# Altium schematic sheet BMS_V1.SchDoc
size 431 x 279 mm; SheetNumber: 1; SheetTotal: 1
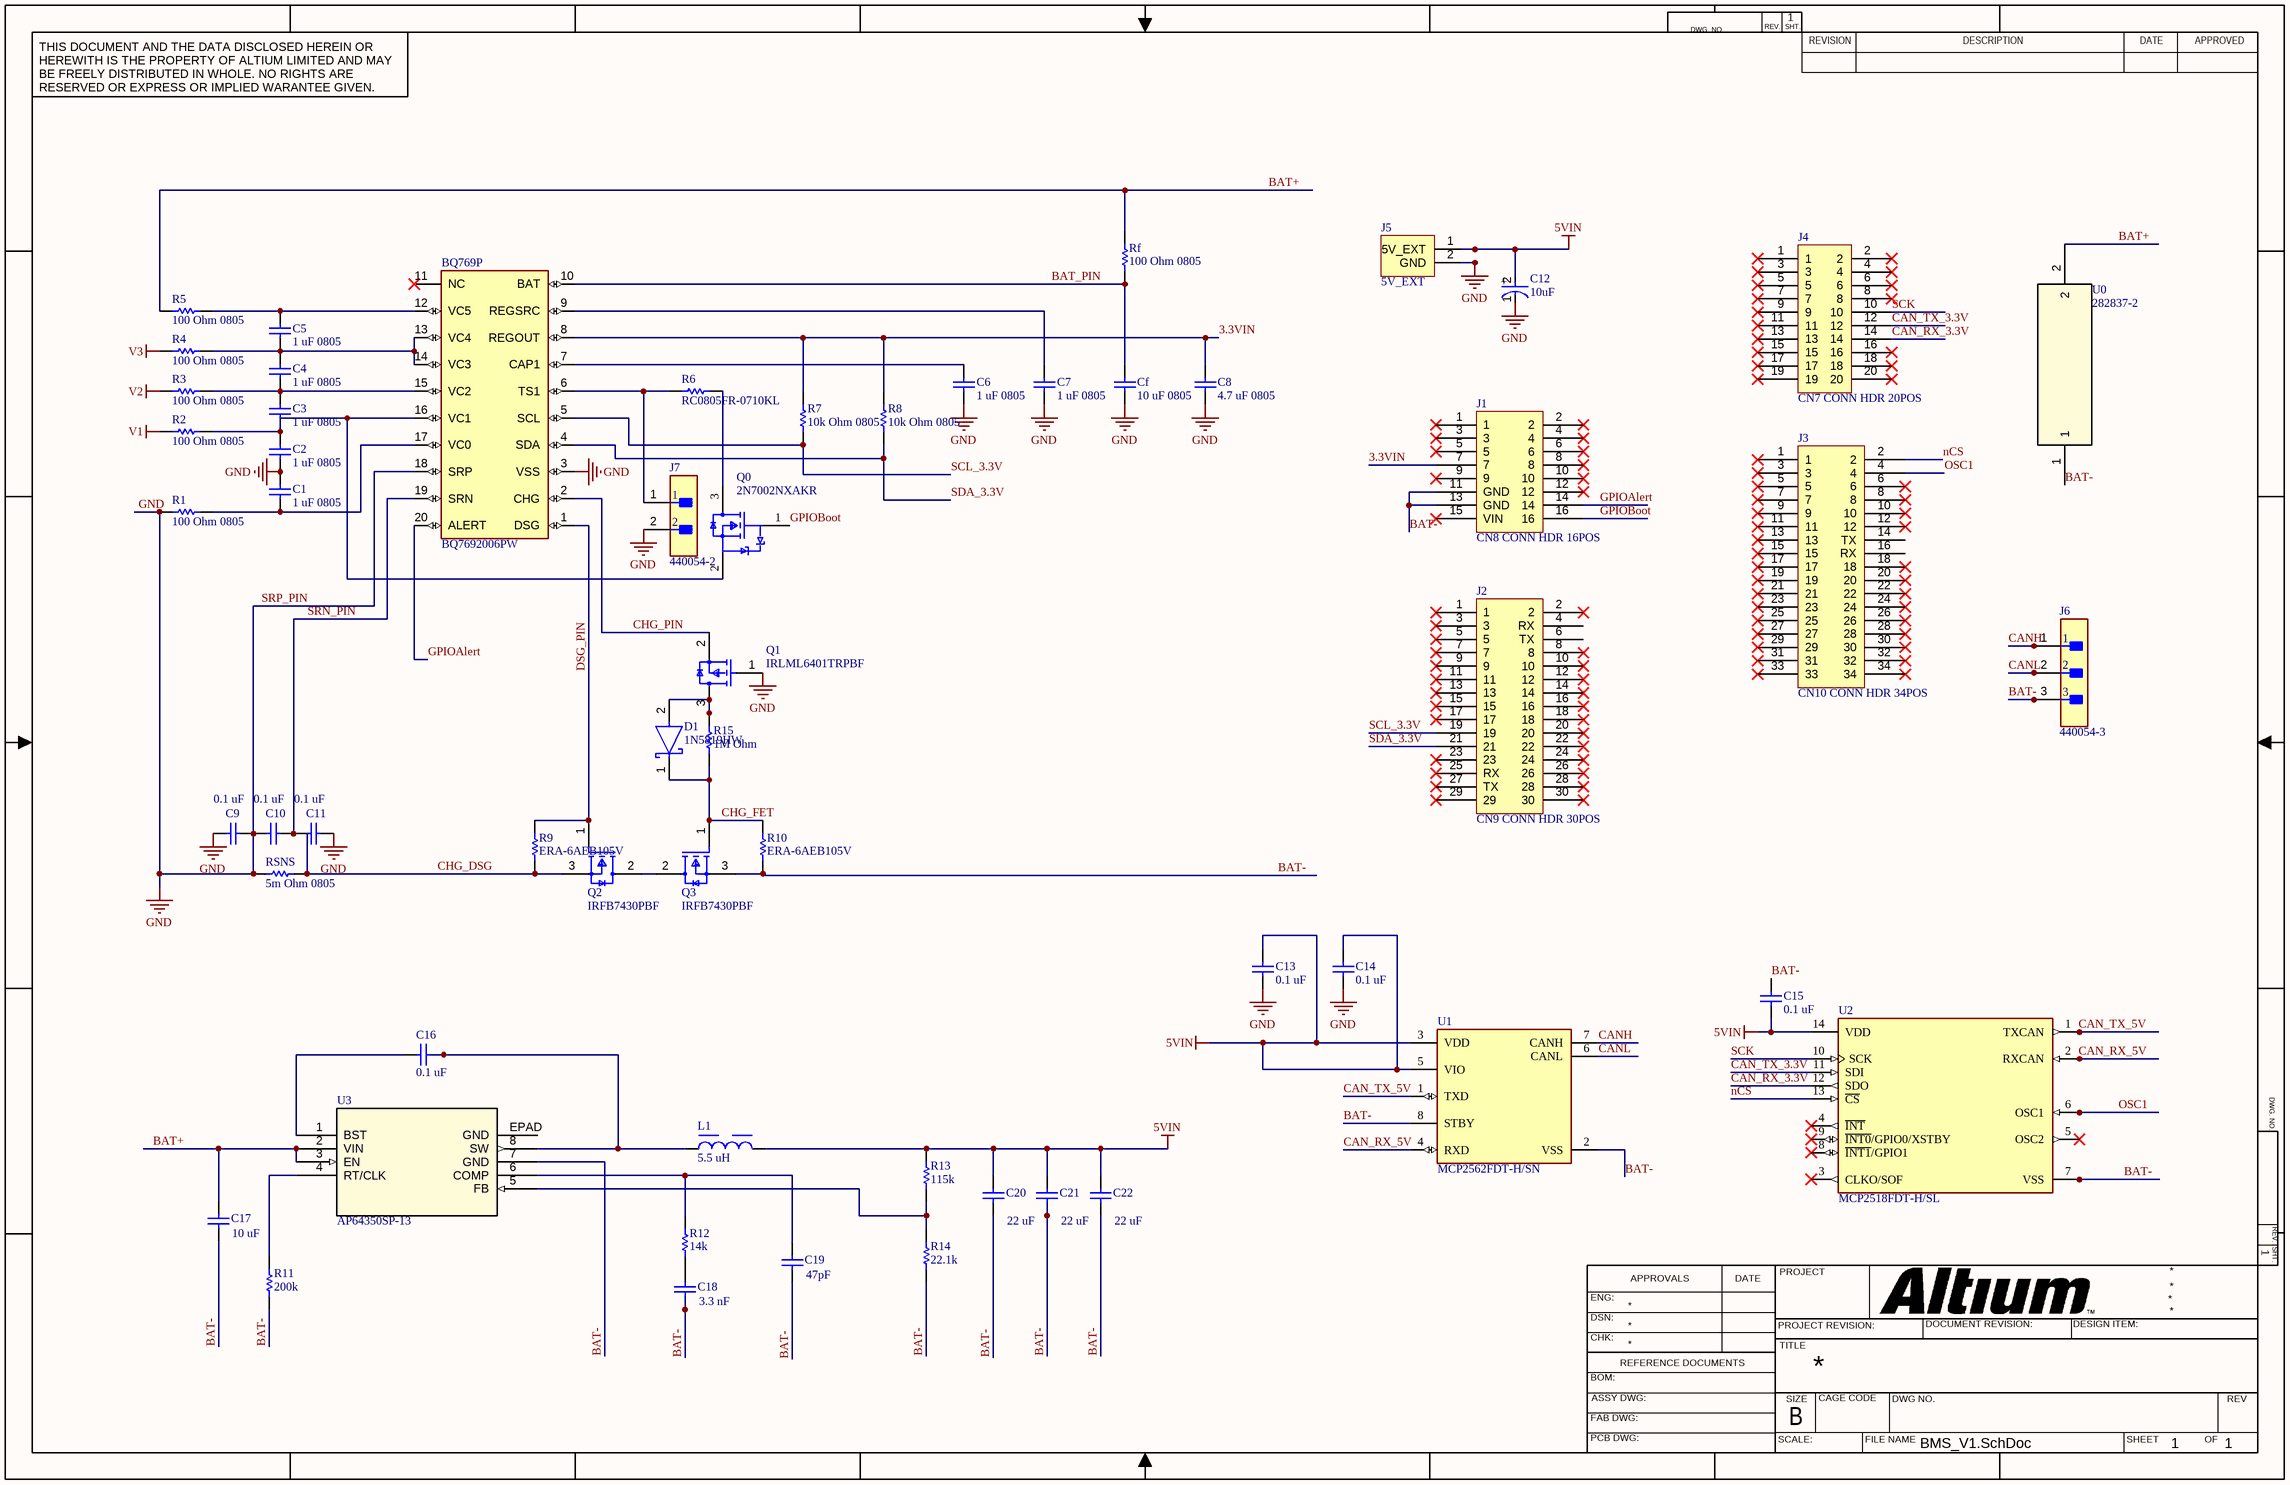
[diagram p0: BMS_V1.SchDoc]

## Parts
BQ769P  BQ7692006PW  [BQ7692006PW]
C1  1 uF 0805  [CAPC2013X140X50LL20T25]
C2  1 uF 0805  [CAPC2013X140X50LL20T25]
C3  1 uF 0805  [CAPC2013X140X50LL20T25]
C4  1 uF 0805  [CAPC2013X140X50LL20T25]
C5  1 uF 0805  [CAPC2013X140X50LL20T25]
C6  1 uF 0805  [CAPC2013X140X50LL20T25]
C7  1 uF 0805  [CAPC2013X140X50LL20T25]
C8  4.7 uF 0805  [CAPC2013X140X50LL20T25]
C9  0.1 uF  [CAPC2013X140X50LL20T25]
C10  0.1 uF  [CAPC2013X140X50LL20T25]
C11  0.1 uF  [CAPC2013X140X50LL20T25]
C12  10uF  [FP-FKC-MFG]
C13  0.1 uF  [CAPC2013X135X45NL10T25]
C14  0.1 uF  [CAPC2013X135X45NL10T25]
C15  0.1 uF  [CAPC2013X135X45NL10T25]
C16  0.1 uF  [CAPC2013X135X45NL10T25]
C17  10 uF  [CAPC2013X135X45NL10T25]
C18  3.3 nF  [CAPC2013X135X45NL10T25]
C19  47pF  [CAPC2013X135X45NL10T25]
C20  22 uF  [CAPC2013X135X45NL10T25]
C21  22 uF  [CAPC2013X135X45NL10T25]
C22  22 uF  [CAPC2013X135X45NL10T25]
Cf  10 uF 0805  [CAPC2013X140X50LL20T25]
D1  1N5819HW  [FP-SOD123-IPC_A]
J1  CN8 CONN HDR 16POS  [CN8_8X2_PADS]
J2  CN9 CONN HDR 30POS  [CN9_15X2_PADS]
J3  CN10 CONN HDR 34POS  [CN10_17X2_PADS]
J4  CN7 CONN HDR 20POS  [CN7_10X2_PADS]
J5  5V_EXT  [5V_EXT]
J6  440054-3  [FP-440054-3-MFG]
J7  440054-2  [FP-440054-2-MFG]
L1  5.5 uH  [WE-HCI_1050]
Q0  2N7002NXAKR  [FP-SOT23-IPC_B]
Q1  IRLML6401TRPBF  [FP-SOT23-MFG]
Q2  IRFB7430PBF  [FP-PG-TO220-3-MFG]
Q3  IRFB7430PBF  [FP-PG-TO220-3-MFG]
R1  100 Ohm 0805  [RESC2013X60X30ML20T20]
R2  100 Ohm 0805  [RESC2013X60X30ML20T20]
R3  100 Ohm 0805  [RESC2013X60X30ML20T20]
R4  100 Ohm 0805  [RESC2013X60X30ML20T20]
R5  100 Ohm 0805  [RESC2013X60X30ML20T20]
R6  RC0805FR-0710KL  [RESC2013X60X35NL10T20]
R7  10k Ohm 0805  [RESC2013X60X30ML20T20]
R8  10k Ohm 0805  [RESC2013X60X30ML20T20]
R9  ERA-6AEB105V  [RESC2013X60X40LL20T25]
R10  ERA-6AEB105V  [RESC2013X60X40LL20T25]
R11  200k  [RESC2013X60X35ML10T20]
R12  14k  [RESC2013X60X35ML10T20]
R13  115k  [RESC2013X60X35ML10T20]
R14  22.1k  [RESC2013X60X35ML10T20]
R15  1M Ohm  [RESC2013X60X40LL20T25]
Rf  100 Ohm 0805  [RESC2013X60X30ML20T20]
RSNS  5m Ohm 0805  [RESC2013X60X30ML20T20]
U0  282837-2  [282837-2_TYC]
U1  MCP2562FDT-H/SN  [FP-C04-057-SN-IPC_A]
U2  MCP2518FDT-H/SL  [FP-C04-065-SL-IPC_B]
U3  AP64350SP-13  [SO-8EP_DIO]

## Nets
5VIN: C12.2(A) C13.2 C14.2 C15.1 C20.2 C21.2 C22.2 J5.1(5V_EXT) L1.2 R13.2 U1.3(VDD) U1.5(VIO) U2.14(VDD)
GND: BQ769P.3(VSS) BQ769P.18(SRP) C1.2 C2.1 C6.1 C7.1 C8.1 C9.1 C9.2 C10.2 C11.1 C12.1(C) C13.1 C14.1 Cf.1 J5.2(GND) J7.2 Q1.1(G) R1.1 RSNS.2  [also labelled SRP_PIN]
V1: R2.1
V2: R3.1
V3: R4.1
3.3VIN: BQ769P.8(REGOUT) C8.2 J1.7 R7.2 R8.2
BAT+: C17.2 R5.1 Rf.2 U0.2 U3.2(VIN) U3.3(EN)
BAT-: C15.2 C17.1 C18.1 C19.1 C20.1 C21.1 C22.1 J1.11(GND) J1.13(GND) J6.3 Q3.3(S) R10.1 R11.1 R14.1 U0.1 U1.2(VSS) U1.8(STBY) U2.7(VSS) U3.7(GND)
BAT_PIN: BQ769P.10(BAT) Cf.2 Rf.1
CAN_RX_3.3V: J4.14 U2.12(SDO)
CAN_RX_5V: U1.4(RXD) U2.2(RXCAN)
CAN_TX_3.3V: J4.12 U2.11(SDI)
CAN_TX_5V: U1.1(TXD) U2.1(TXCAN)
CANH: J6.1 U1.7(CANH)
CANL: J6.2 U1.6(CANL)
CHG_DSG: Q2.3(S) R9.1 RSNS.1
CHG_FET: D1.1(C) Q3.1(G) R10.2 R15.1
CHG_PIN: BQ769P.2(CHG) Q1.2(S)
DSG_PIN: BQ769P.1(DSG) Q2.1(G) R9.2
GPIOAlert: BQ769P.20(ALERT) J1.14
GPIOBoot: J1.16 Q0.1(G)
nCS: J3.2 U2.13(~{CS})
OSC1: J3.4 U2.6(OSC1)
SCK: J4.10 U2.10(SCK)
SCL_3.3V: BQ769P.5(SCL) J2.19 R7.1
SDA_3.3V: BQ769P.4(SDA) J2.21 R8.1
SRN_PIN: BQ769P.19(SRN) C10.1 C11.2
NetBQ769P_6: BQ769P.6(TS1) J7.1 R6.1
NetBQ769P_7: BQ769P.7(CAP1) C6.2
NetBQ769P_9: BQ769P.9(REGSRC) C7.2
NetBQ769P_12: BQ769P.12(VC5) C5.2 R5.2
NetBQ769P_13: BQ769P.13(VC4) BQ769P.14(VC3) C4.2 C5.1 R4.2
NetBQ769P_15: BQ769P.15(VC2) C3.2 C4.1 R3.2
NetBQ769P_16: BQ769P.16(VC1) C2.2 C3.1 Q0.2(S) R2.2
NetBQ769P_17: BQ769P.17(VC0) C1.1 R1.2
NetC16_1: C16.1 L1.1 U3.8(SW)
NetC16_2: C16.2 U3.1(BST)
NetC18_2: C18.2 R12.1
NetC19_2: C19.2 R12.2 U3.6(COMP)
NetD1_2: D1.2(A) Q1.3(D) R15.2
NetQ0_3: Q0.3(D) R6.2
NetQ2_2: Q2.2(D) Q3.2(D)
NetR11_2: R11.2 U3.4(RT/CLK)
NetR13_1: R13.1 R14.2 U3.5(FB)

Not connected (* = marked no-connect by the designer): BQ769P 11(NC)*; J1 1* 2* 3* 4* 5* 6* 8* 9* 10* 12* 15(VIN)*; J2 1* 2* 3* 4(RX) 5* 6(TX) 7* 8* 9* 10* 11* 12* 13* 14* 15* 16* 17* 18* 20* 22* 23* 24* 25(RX)* 26* 27(TX)* 28* 29* 30*; J3 1* 3* 5* 6* 7* 8* 9* 10* 11* 12* 13* 14(TX) 15* 16(RX) 17* 18* 19* 20* 21* 22* 23* 24* 25* 26* 27* 28* 29* 30* 31* 32* 33* 34*; J4 1* 2* 3* 4* 5* 6* 7* 8* 9* 11* 13* 15* 16* 17* 18* 19* 20*; U2 3(CLKO/SOF)* 4(~{INT})* 5(OSC2)* 8(~{INT1}/GPIO1)* 9(~{INT0}/GPIO0/XSTBY)*; U3 EPAD(GND)

## Notes on the sheet
- DWG. NO.
- REV.
- SHT.
- THIS DOCUMENT AND THE DATA DISCLOSED HEREIN OR HEREWITH IS THE PROPERTY OF ALTIUM LIMITED AND MAY BE FREELY DISTRIBUTED IN WHOLE. NO RIGHTS ARE RESERVED OR EXPRESS OR IMPLIED WARANTEE GIVEN.
- REVISION
- DESCRIPTION
- DATE
- APPROVED
- ENG:
- APPROVALS
- PROJECT
- DSN:
- CHK:
- REFERENCE DOCUMENTS
- PROJECT REVISION:
- TITLE
- DOCUMENT REVISION:
- DESIGN ITEM:
- BOM:
- FAB DWG:
- PCB DWG:
- ASSY DWG:
- SCALE:
- SIZE
- B
- CAGE CODE
- FILE NAME
- DWG NO.
- SHEET
- OF
- REV
- (in symbol CMP-05427-000030-1) +

## Library data of the parts
BQ769P = CMP-006-000000-1: 3 to 5-Series Cell Li-Ion and Li-Phosphate Battery Monitor (bq76940 Family); MF: Texas Instruments; Design Item ID: BQ7692006PW; Pin Count: 20; Value: *; Source: BQ7692006PW.SchLib; MP: BQ7692006PW; Component Type: Standard; Check_prices: https://www.snapeda.com/parts/BQ7692006PW/Texas+Instruments/view-part/?ref=eda; Package: TSSOP-20 Texas Instruments; SnapEDA_Link: https://www.snapeda.com/parts/BQ7692006PW/Texas+Instruments/view-part/?ref=snap
C1-C11 Cf = CMP-2007-03234-1: Part Number: C0805C105K3RACTU; Manufacturer: Kemet
C12 = CMP-05427-000030-1: CAP ALUM 10UF 20% 50V SMD; Impedance: 1.52R; Ripple Current (AC): 85mA; Life (Hours): 2000Hour; Leakage Current: 3uA; Dielectric Material: Aluminium; Length: 5.8mm; Voltage Rating: 50V; Radiation Hardening: No; Max Operating Temperature: 105°C; REACH SVHC: No SVHC; Tolerance: 20%; RoHS Compliant: Yes; Case/Package: Radial; Height: 5.8mm; Voltage: 50V; Diameter: 5mm; Number of Pins: 2; Ripple Current: 85mA; Series: FK; Lead Free: Lead Free; Width: 6.5mm; ESR (Equivalent Series Resistance): 1.52R; Package Quantity: 1000; Construction: Cylindrical; Voltage Rating (DC): 50V; Packaging: Tape and Reel; Height - Seated (Max): 0.228inch; Contact Plating: Tin; Capacitance: 10uF; Min Operating Temperature: -55°C; Termination: SMD/SMT; Material: Aluminium; Mount: Surface Mount
C13-C22 = CMP-1662-00015-2: Chip Capacitor, 4.7 uF, +/- 10%, 16 V, -55 to 85 degC, 0805 (2012 Metric), RoHS, Tape and Reel; PartNumber: GRM21BR61C475KA88L; Voltage Rating (DC): 16 V; Capacitance: 4.7 uF; Type (Capacitors): X5R; Case\/Package: 0805; Pins: 2; DatasheetVersion: 03/2016; REACH SVHC: No SVHC; Tolerance: 10%; Width: 1.25 mm; Mount: Surface Mount; ComponentLink1Description: Manufacturer URL; Case Code (Metric): 2012; PackageDescription: 2-Pin Surface Mount Device, Body 2 x 1.25 mm; Height: 1.25 mm; Voltage Rating: 16 V; Max Operating Temperature: 85 degC; RoHSCompliant: true; Length: 2 mm; ComponentLink1URL: http://www.murata.com/; Mounting Technology: Surface Mount; Packaging: Tape and Reel; Min Operating Temperature: -55 degC; ComponentLink2Description: Datasheet; Case Code (Imperial): 0805; Radiation Hardening: No; Package Quantity: 3000; PackageReference: 0805; ComponentLink2URL: http://search.murata.co.jp/Ceramy/image/img/A01X/G101/ENG/GRM21BR61C475KA88-01.pdf
D1 = CMP-0303-00003-3: DIODE SCHOTTKY 40V 1A SOD123; Forward Voltage: 450mV; Capacitance: 110pF; Max Forward Surge Current (Ifsm): 25A; Peak Reverse Current: 50uA; Polarity: Standard; Element Configuration: Single; Max Power Dissipation: 450mW; Min Operating Temperature: -65°C; Package Quantity: 3000; Contact Plating: Tin; Weight: 0.000353oz; Max Repetitive Reverse Voltage (Vrrm): 40V; Max Reverse Voltage (DC): 40V; Height: 1.25mm; Average Rectified Current: 1A; Width: 1.7mm; Case/Package: SOD-123-2; Lead Free: Lead Free; Max Operating Temperature: 125°C; Current Rating: 1A; Termination: SMD/SMT; Forward Current: 1A; Radiation Hardening: No; Number of Pins: 2; Length: 2.85mm; Voltage Rating (DC): 40V; REACH SVHC: No SVHC; Peak Non-Repetitive Surge Current: 25A; Packaging: Tape and Reel; Output Current: 1A
J1 = CMP-009-000002-1: CN8 CONN HDR 16POS 0.1 STACK; Source: Schlib2.SchLib; Design Item ID: CN8 CONN HDR 16POS
J2 = CMP-009-000003-1: CN9 CONN HDR 30 POS  0.1 STACK; Source: Schlib2.SchLib; Design Item ID: CN9 CONN HDR 30POS
J3 = CMP-009-000004-1: CN10 CONN HDR 34 POS  0.1 STACK; Design Item ID: CN10 CONN HDR 34POS; Source: Schlib2.SchLib
J4 = CMP-009-000001-1: CN7 CONN HDR 20 POS  0.1 STACK; Source: Schlib2.SchLib; Design Item ID: CN7 CONN HDR 20POS
J5 = CMP-011-000000-1: Source: Schlib2.SchLib; Design Item ID: 5V_EXT
J6 = CMP-03369-000008-1: CONN HEADER VERT 3POS 2MM; Manufacturer: TE Connectivity; Voltage Rating: 250V; Number Of Contacts: 3; Conn Gender: Male; Conn Orientation: Vertical; Current Rating: 3A; Octopart: https://octopart.com/440054-3-te+connectivity-40394845; Device Class L3: unset; Device Class L1: Connectors; Number Of Rows: 1; Temperature: -25°C to +105°C; Temperature Range Low: -25°C; Automotive: No; Package: 0; Manufacturer Part Number: 440054-3; ComponentLink2URL: https://www.te.com/usa-en/product-440054-3.datasheet.pdf; Device Class L2: Headers and Wire Housings; Temperature Range High: +105°C; Digikey Description: CONN HEADER VERT 3POS 2MM; Contact Material: Tin,Nickel; Footprint Url: https://www.te.com/commerce/DocumentDelivery/DDEController?Action=showdoc&DocId=Customer+Drawing%7F440054%7FF6%7Fpdf%7FEnglish%7FENG_CD_440054_F6.pdf%7F440054-3; RoHS: TRUE; ComponentLink2Description: Datasheet; Mouser Description: Headers & Wire Housings 3 POS HDR VERT 2.0mm; Lead Free: Yes; Category: Conn; Height: 6.35mm; Pitch: 2mm
J7 = CMP-03369-000005-1: CONN HEADER VERT 2POS 2MM; Manufacturer: TE Connectivity; Conn Gender: Male; Conn Orientation: Vertical; Voltage Rating: 250V; Number Of Contacts: 2; Current Rating: 3A; ComponentLink2Description: Datasheet; Temperature Range Low: -25°C; Contact Material: Tin,Nickel; Device Class L3: unset; Digikey Description: CONN HEADER VERT 2POS 2MM; Temperature: -25°C to +85°C; Mouser Description: Headers & Wire Housings 2.0mm HDR 2pos VERT HPI; Manufacturer Part Number: 440054-2; Package: 440054-2; Lead Free: Yes; ComponentLink2URL: https://www.te.com/usa-en/product-440054-2.datasheet.pdf; Number Of Rows: 1; Octopart: https://octopart.com/440054-2-te+connectivity-40237927; Category: Conn; Temperature Range High: +85°C; Footprint Url: https://www.te.com/commerce/DocumentDelivery/DDEController?Action=showdoc&DocId=Customer+Drawing%7F440054%7FF6%7Fpdf%7FEnglish%7FENG_CD_440054_F6.pdf%7F440054-2; Pitch: 2mm; Device Class L1: Connectors; RoHS: TRUE; Height: 6.35mm; Device Class L2: Headers and Wire Housings; Automotive: No
L1 = CMP-0226-00138-2: NexarPartId: 7866439; Shielding: Shielded; Series Resistance: 10.3Ω; Inductance: 5.5µH; Inductance Tolerance: 20%; Current Rating: 10A; DC Resistance (DCR): 10.3mΩ; Self Resonant Frequency: 30MHz; Saturation Current: 12A; Test Frequency: 100kHz; Max Operating Temperature: 150°C; Case/Package: 1050; Lead Free: Lead Free; Number of Pins: 2; Ambient Temperature Range High: 100°C; Height: 4.7mm; Mount: Surface Mount; Composition: Wirewound; Ambient Temperature Range Low: -40°C; RoHS: Compliant; Length: 10.5mm; Max DC Current: 10A; RMS Current (Irms): 10A; Width: 10.2mm; Resistance: 10.3mΩ; Packaging: Cut Tape (CT); Tolerance: 20%; Height - Seated (Max): 5.0038mm; REACH SVHC: Unknown; Depth: 10.2mm; Min Operating Temperature: -40°C; Termination: SMD/SMT
Q0 = CMP-14409-000026-2: 2N7002NXAK/SOT23/TO-236AB
Q1 = CMP-32901-000098-1: MOSFET P-CH 12V 4.3A SOT-23; Manufacturer: Infineon; Drain To Source Resistance: 0.05Ω; Pulse Drain Current: -34A; Reverse Recovery Time: 22ns; Depletion Mode: False; Gate To Source Voltage: 8V; Number Of P Channels: 1; Turn Off Delay Time: 250ns; Gate Charge At Vgs: 10nC @ -5V; Max Forward Diode Voltage: -1.2V; Input Capacitace At Vds: 830pF @ -10V; Turn On Delay Time: 11ns; Drain To Source Voltage: -12V; Rthja Max: 75°C/W; Max Junction Temp: +150°C; Standoff Height: 0.01mm; Continuous Drain Current: -4.3A; Power Dissipation: 1.3W; Threshold Vgs Max: -0.95V; Reverse Recovery Charge: 8nC; Threshold Vgs Min: -0.4V; Digikey Description: MOSFET P-CH 12V 4.3A SOT-23; RoHS: TRUE; ComponentLink2Description: Datasheet; Device Class L1: Discrete Semiconductors; Package: SOT23; Octopart: https://octopart.com/irlml6401trpbf-infineon-65874987; Temperature Range High: +150°C; Manufacturer Part Number: IRLML6401TRPBF; Automotive: No; Category: Trans; Temperature: -55°C to +150°C; Device Class L2: Transistors; Height: 1.12mm; Ipc Land Pattern Name: SOT95P237X100-3; Device Class L3: MOSFETs; Number Of Channels: 1; ComponentLink2URL: https://www.infineon.com/dgdl/irlml6401pbf.pdf?fileId=5546d462533600a401535668b96d2634; Lead Free: Yes; Drain To Source Breakdown Voltage: -12V; Temperature Range Low: -55°C
Q2 Q3 = CMP-32901-000979-1: MOSFET N CH 40V 195A TO220; Rds On Max: 1.3mR; Input Capacitance: 14.24nF; Max Power Dissipation: 375W; Threshold Voltage: 2.2V; REACH SVHC: No SVHC; Continuous Drain Current (ID): 195A; Min Operating Temperature: -55°C; Case/Package: TO-220; Packaging: Rail/Tube; Mount: Through Hole; Max Operating Temperature: 175°C; RoHS Compliant: Yes; Number of Pins: 3; Max Dual Supply Voltage: 40V; Drain to Source Voltage (Vdss): 40V; Lead Free: Lead Free; Halogen Free: Halogen Free; Series: HEXFET®, StrongIRFET™
R1-R5 R7 R8 Rf RSNS = CMP-2001-01991-1: Part Number: RK73H2ATTD1000F; Manufacturer: KOA Speer
R6 = CMP-1659-00013-4: Chip Resistor, 10 KOhm, +/- 1%, 0.125 W, -55 to 155 degC, 0805 (2012 Metric), RoHS, Tape and Reel; Manufacturer: Yageo; Voltage Rating: 150 V; Mount: Surface Mount; ComponentLink1Description: Manufacturer URL; ComponentLink2URL: http://www.yageo.com/documents/recent/PYu-RC_Group_51_RoHS_L_04.pdf; Pins: 2; Length: 2 mm; Min Operating Temperature: -55 degC; Height: 0.5 mm; Mounting Technology: Surface Mount; RoHSCompliant: true; REACH SVHC: No SVHC; ComponentLink1URL: http://www.yageo.com/; Max Operating Temperature: 155 degC; PackageReference: 0805; DatasheetVersion: Rev. 4, 02/2016; Package Quantity: 5000; Packaging: Tape and Reel; ComponentLink2Description: Datasheet; PackageDescription: 2-Pin Surface Mounted Device, Body 2 x 1.25 mm
R9 R10 = CMP-2001-00584-1: Manufacturer: Panasonic; Part Number: ERA-6AEB105V
R11-R14 = CMP-2100-03671-1: Chip Resistor, 1 KOhm, +/- 1%, 125 mW, -55 to 155 degC, 0805 (2012 Metric), RoHS, Tape and Reel; Manufacturer: Yageo; Temperature Coefficient: 100ppm/degreesC; Voltage Rating (DC): 150V; Max Power Dissipation: 125mW; Resistance: 1KOhm; Number of Pins: 2; Number of Terminations: 2; Datasheet URL: http://www.yageo.com/NewPortal/yageodocoutput?fileName=/pdf/R-Chip/PYu-RC_Group_51_RoHS_L_5.pdf; Length: 0.079inch; Package Description: 2-Pin Surface Mounted Device, Body 2 x 1.25 mm; Depth: 1.25mm; Height: 0.024inch; Military Standard: Not; Case/Package: 0805; Package Reference: 0805; RoHSCompliant: true; Lead Free: LeadFree; Packaging: TapeandReel; Package Quantity: 1; Datasheet Version: Rev. 5, 10/2016; Tolerance: 1%; Min Operating Temperature: -55degC; Voltage Rating: 150V; Composition: ThickFilm; Case Code (Imperial): 0805; Power Rating: 125mW; Width: 0.049inch; Case Code (Metric): 2012; Manufacturer URL: http://www.yageo.com/; Max Operating Temperature: 155degC; REACH SVHC: Unknown; Termination: SMD/SMT
R15 = CMP-2001-00584-1: Part Number: ERA-6AEB105V; Manufacturer: Panasonic
U0 = CMP-011-000003-1: No Description Available; Mfr_Name: TE Connectivity; RefDes: RefDes; Type: Type; Design Item ID: 282837-2; Source: Schlib2.SchLib
U1 = CMP-06279-000047-1: IC TRANSCEIVER 1/1 8SOIC; Operating Supply Current: 70mA; Receiver Hysteresis: 200mV; Max Supply Voltage: 5.5V; Number of Transceivers: 1; Min Supply Voltage: 4.5V; Data Rate: 8Mbps; Case/Package: SOIC; Weight: 0.019048oz; Package Quantity: 3300; Max Operating Temperature: 150°C; Packaging: Tape and Reel; RoHS Compliant: Yes; Series: -; Number of Pins: 8; Min Operating Temperature: -40°C; Mount: Surface Mount
U2 = CMP-06298-000020-1: IC CAN CONTROLLER SPI 14SOIC; RoHS Compliant: Yes
U3 = CMP-011-000008-1: No Description Available; Mfr_Name: Diodes Inc; Design Item ID: AP64350SP-13; Source: Schlib2.SchLib; Type: Type; RefDes: RefDes